# EAGLE schematic D8035E_pcb_c.v1 (EAGLE 5.07)
LICENSE: CC-0; URL1: http://DangerousPrototypes.com
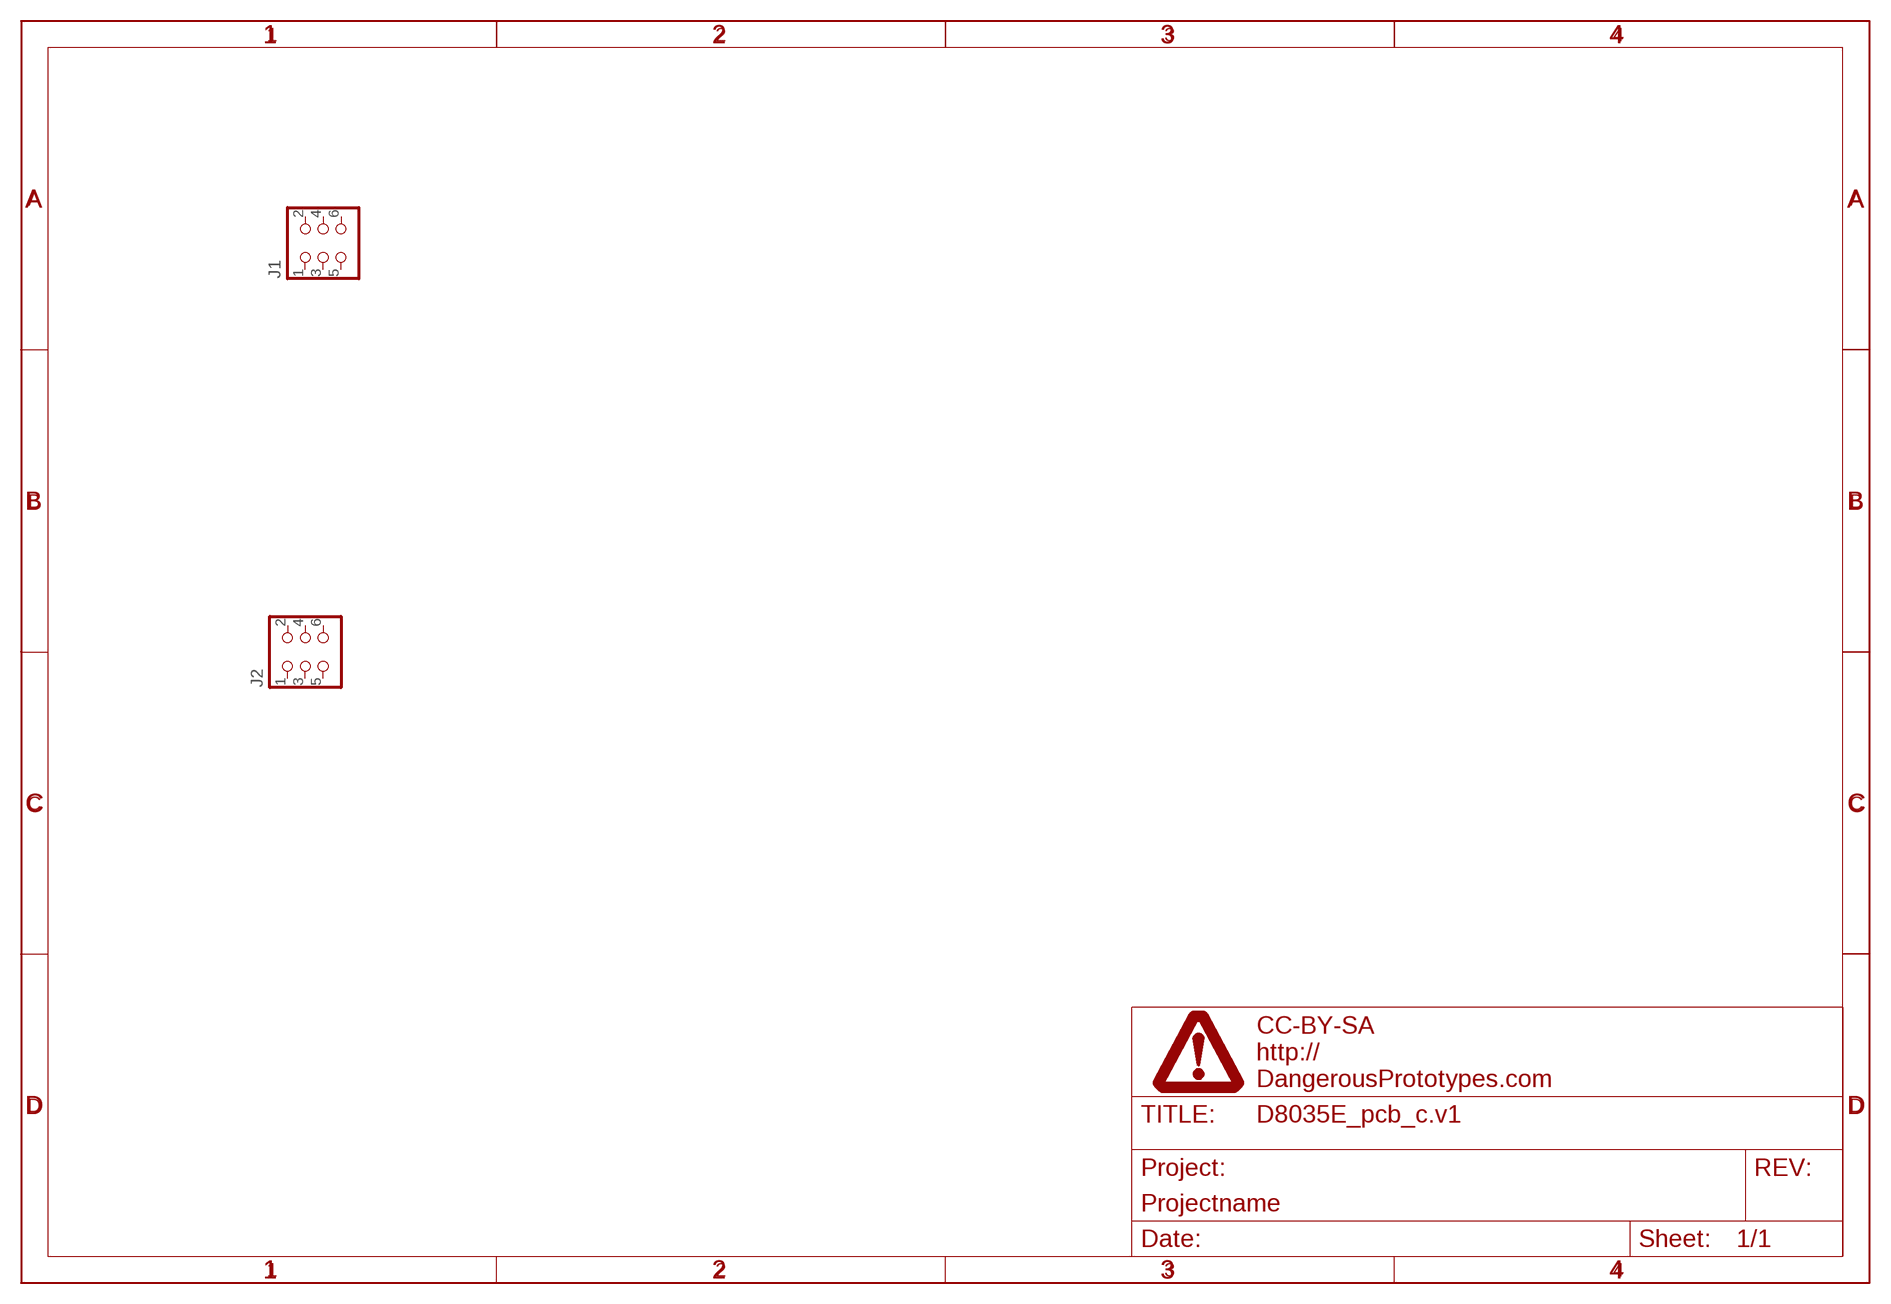
[diagram p0: schematic, sheet 1]

## Parts
J1  CON_HEADER_2X03-PTH  [M2X3]
J2  CON_HEADER_2X03-PTH  [M2X3]
U$1  FRAME_DINA4_L  [DP_LOGO]
Unconnected: J1.1 J1.2 J1.3 J1.4 J1.5 J1.6 J2.1 J2.2 J2.3 J2.4 J2.5 J2.6

## Library data of the parts
J1 J2 = dp_devices:CON_HEADER_2X03
U$1 = dp_devices:FRAME_DINA4_L: A4 DP frame Standard Dangerous Prototypes schematic frame. Automagically adds the DP logo and standard texts to the PCB Use the atrribute in the schematic editor to change the fields.; FF1: fulfillment by; FF2: Seeed Studio; FF3: www.seeedstudio.com; LICENSE: CC-BY-SA; PROJECT: Projectname; URL1: http://; URL2: DangerousPrototypes.com